# EAGLE schematic board (EAGLE 6.2)
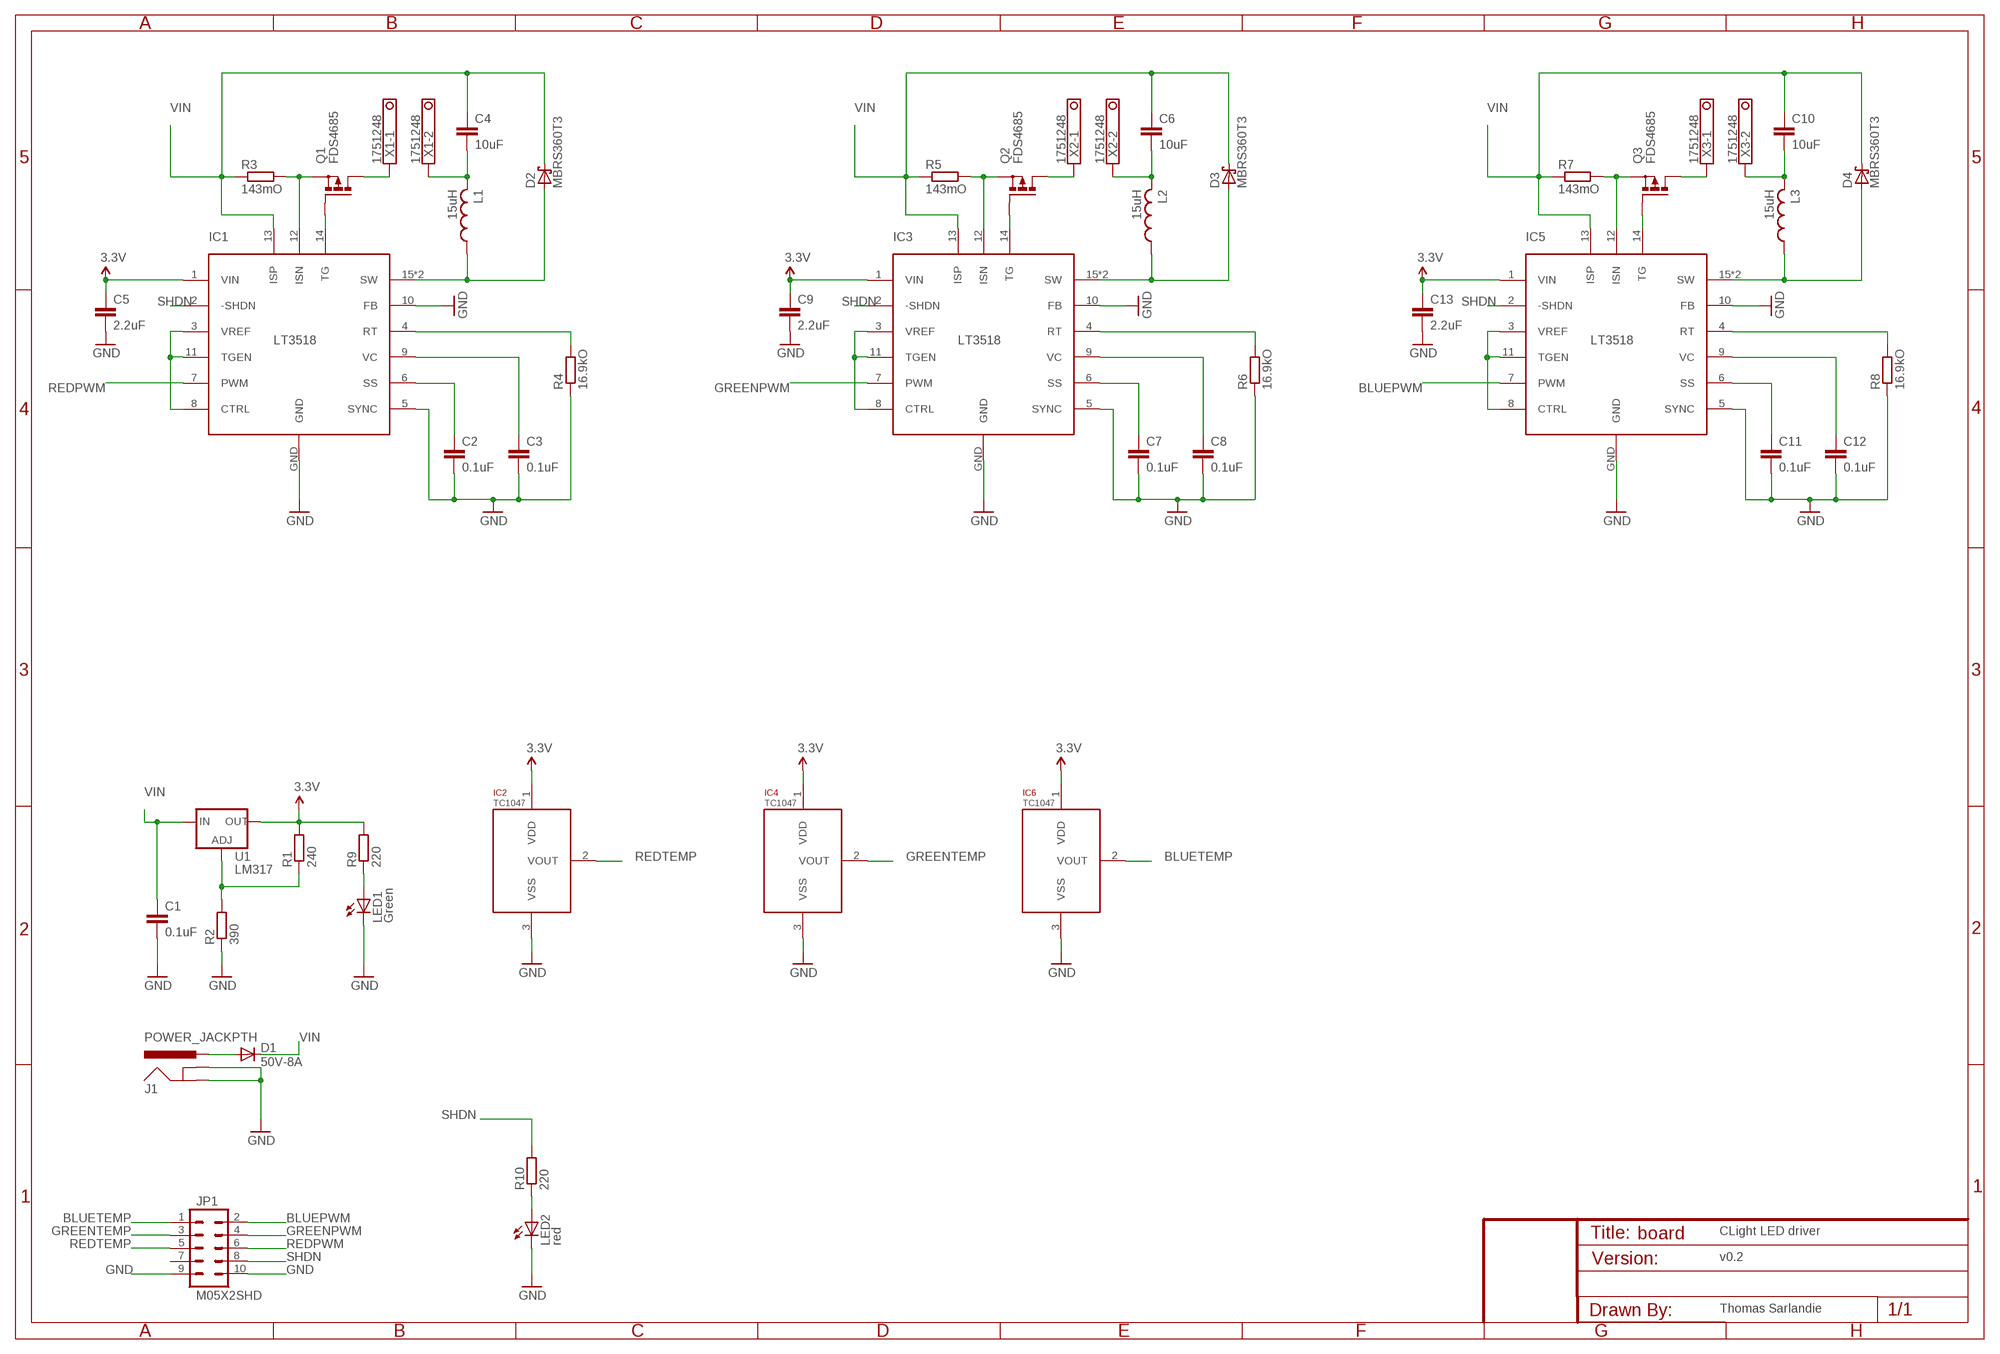
[diagram p0: schematic, sheet 1]

## Parts
C1  0.1uF  C-EUC1206  [C1206]
C2  0.1uF  C-EUC1206  [C1206]
C3  0.1uF  C-EUC1206  [C1206]
C4  10uF  C-EUC1206  [C1206]
C5  2.2uF  C-EUC1206  [C1206]
C6  10uF  C-EUC1206  [C1206]
C7  0.1uF  C-EUC1206  [C1206]
C8  0.1uF  C-EUC1206  [C1206]
C9  2.2uF  C-EUC1206  [C1206]
C10  10uF  C-EUC1206  [C1206]
C11  0.1uF  C-EUC1206  [C1206]
C12  0.1uF  C-EUC1206  [C1206]
C13  2.2uF  C-EUC1206  [C1206]
D1  50V-8A  DIODE-SMC  [SMC]
D2  MBRS360T3  MBRS340T3  [SMC]
D3  MBRS360T3  MBRS340T3  [SMC]
D4  MBRS360T3  MBRS340T3  [SMC]
IC1  LT3518TSSOP16-EXPOSED-PAD-LARGE  [TSSOP16-EXPOSED_PAD_LARGE]
IC2  TC1047  TC1047SOT-23B  [SOT-23B]
IC3  LT3518TSSOP16-EXPOSED-PAD-LARGE  [TSSOP16-EXPOSED_PAD_LARGE]
IC4  TC1047  TC1047SOT-23B  [SOT-23B]
IC5  LT3518TSSOP16-EXPOSED-PAD-LARGE  [TSSOP16-EXPOSED_PAD_LARGE]
IC6  TC1047  TC1047SOT-23B  [SOT-23B]
J1  POWER_JACKPTH  [POWER_JACK_PTH]
JP1  M05X2SHD  [2X5-SHROUDED]
L1  15uH  L-USL2020  [L2020]
L2  15uH  L-USL2020  [L2020]
L3  15uH  L-USL2020  [L2020]
LED1  Green  LED1206  [LED-1206]
LED2  red  LED1206  [LED-1206]
Q1  FDS4685  P-MOSFET-SO8  [SO-08]
Q2  FDS4685  P-MOSFET-SO8  [SO-08]
Q3  FDS4685  P-MOSFET-SO8  [SO-08]
R1  240  R-EU_R1206  [R1206]
R2  390  R-EU_R1206  [R1206]
R3  143mO  R-EU_R1206  [R1206]
R4  16.9kO  R-EU_R1206  [R1206]
R5  143mO  R-EU_R1206  [R1206]
R6  16.9kO  R-EU_R1206  [R1206]
R7  143mO  R-EU_R1206  [R1206]
R8  16.9kO  R-EU_R1206  [R1206]
R9  220  R-EU_R1206  [R1206]
R10  220  R-EU_R1206  [R1206]
U1  LM317  V_REG_317SMD  [SOT223]
X1  1751248  [1751248]
X2  1751248  [1751248]
X3  1751248  [1751248]

## Nets
3.3V: C5.1 C9.1 C13.1 IC1.1(VIN) IC2.1(VDD) IC3.1(VIN) IC4.1(VDD) IC5.1(VIN) IC6.1(VDD) R1.2 R9.2 U1.2(OUT)
BLUEPWM: IC5.7(PWM) JP1.2
BLUETEMP: IC6.2(VOUT) JP1.1
GND: C1.2 C2.2 C3.2 C5.2 C7.2 C8.2 C9.2 C11.2 C12.2 C13.2 IC1.5(SYNC) IC1.10(FB) IC1.GND IC2.3(VSS) IC3.5(SYNC) IC3.10(FB) IC3.GND IC4.3(VSS) IC5.5(SYNC) IC5.10(FB) IC5.GND IC6.3(VSS) J1.GND J1.GNDBREAK JP1.9 JP1.10 LED1.C LED2.C R2.1 R4.1 R6.1 R8.1
GREENPWM: IC3.7(PWM) JP1.4
GREENTEMP: IC4.2(VOUT) JP1.3
N$1: IC1.3(VREF) IC1.8(CTRL) IC1.11(TGEN)
N$2: IC3.3(VREF) IC3.8(CTRL) IC3.11(TGEN)
N$3: R1.1 R2.2 U1.1(ADJ)
N$4: IC3.12(ISN) Q2.1(S) Q2.2(S) Q2.3(S) R5.2
N$5: IC1.12(ISN) Q1.1(S) Q1.2(S) Q1.3(S) R3.2
N$6: IC1.14(TG) Q1.4(G)
N$7: Q1.5(D) Q1.6(D) Q1.7(D) Q1.8(D) X1.1
N$8: C4.2 L1.P$2 X1.2
N$9: D2.A IC1.15(SW) IC1.16(SW) L1.P$1
N$10: IC3.14(TG) Q2.4(G)
N$11: IC1.4(RT) R4.2
N$12: Q2.5(D) Q2.6(D) Q2.7(D) Q2.8(D) X2.1
N$13: C6.2 L2.P$2 X2.2
N$14: D3.A IC3.15(SW) IC3.16(SW) L2.P$1
N$15: C2.1 IC1.6(SS)
N$16: C3.1 IC1.9(VC)
N$17: IC3.4(RT) R6.2
N$18: C7.1 IC3.6(SS)
N$19: C8.1 IC3.9(VC)
N$20: IC5.3(VREF) IC5.8(CTRL) IC5.11(TGEN)
N$21: IC5.12(ISN) Q3.1(S) Q3.2(S) Q3.3(S) R7.2
N$22: IC5.14(TG) Q3.4(G)
N$23: Q3.5(D) Q3.6(D) Q3.7(D) Q3.8(D) X3.1
N$24: C10.2 L3.P$2 X3.2
N$25: D4.A IC5.15(SW) IC5.16(SW) L3.P$1
N$26: IC5.4(RT) R8.2
N$27: C11.1 IC5.6(SS)
N$28: C12.1 IC5.9(VC)
N$29: D1.A J1.PWR
N$31: LED1.A R9.1
N$34: LED2.A R10.1
REDPWM: IC1.7(PWM) JP1.6
REDTEMP: IC2.2(VOUT) JP1.5
SHDN: IC1.2(-SHDN) IC3.2(-SHDN) IC5.2(-SHDN) JP1.8 R10.2
VIN: C1.1 C4.1 C6.1 C10.1 D1.C D2.C D3.C D4.C IC1.13(ISP) IC3.13(ISP) IC5.13(ISP) R3.1 R5.1 R7.1 U1.3(IN)
Unconnected: JP1.7

## Notes on the sheet
- CLight LED driver
- v0.2
- Thomas Sarlandie

## Library data of the parts
C1-C13 = rcl:C-EU: CAPACITOR, European symbol
D1 = diode:DIODE-: DIODE
D2-D4 = diode:MBRS3*0T3: SCHOTTKY BARRIER RECTIFIER 3.0 AMPERES 20, 30, 40 VOLT Source: MBRS340T3-D.pdf
IC1 IC3 IC5 = lt3518:LT3518: Full-Featured LED Driver with 2.3A Switch Current
IC2 IC4 IC6 = tc1047:TC1047
J1 = SparkFun:POWER_JACK: Power Jack This is the standard 5.5mm barrel jack for power. The PTH is the most common, proven, reliable, footprint. All others are experimental. The Slot footprint only works if the mill layer is transmitted to the PCB fab house so be warned. Spark Fun Electronics SKU : PRT-00119. Mating wall wart : TOL-00298 (and others)
JP1 = SparkFun:M05X2: Header 5x2 Standard 10-pin dual row 0.1" header. Commonly used with AVR-ISP. Use with Spark Fun Electronics SKU: PRT-00778
L1-L3 = l2020:L-US: INDUCTOR, American symbol
LED1 LED2 = SparkFun:LED: LEDs Standard schematic elements and footprints for 5mm, 3mm, 1206, and 0603 sized LEDs. 5mm - Spark Fun Electronics SKU : COM-00529 (and others)
Q1-Q3 = transistor-power:P-MOSFET-SO8: P-Channel MOSFET Example: FDS4435A; P-Channel Logic Level PowerTrench® MOSFET FDS4465; P-Channel 1.8V Specified PowerTrench® MOSFET Source: www.fairchildsemi.com
R1-R10 = rcl:R-EU_: RESISTOR, European symbol
U1 = SparkFun:V_REG_317: Voltage Regulator Standard LM317 adjustable voltage regulator. AOI (Adjust Output Input). Google 'LM317 Calculator' for easy to use app to get the two resistor values needed. 240/720 for 5V output. 240/390 for 3.3V output. Spark Fun Electronics SKU : COM-00527
X1-X3 = con-phoenix-350:1751248: MKDS 1/ 2-3,5 Printklemme Nennstrom: 10 A Bemessungsspannung: 160 V Raster: 3,5 mm Polzahl: 2 Montageart: Löten Anschlussart: Schraubanschluss Anschlussrichtung vom Leiter zur Platine: 0° Source: http://eshop.phoenixcontact.com .. 1751248.pdf; OC_FARNELL: unknown; OC_NEWARK: unknown